# Altium schematic sheet AIR_Connection.SchDoc
size A4; Organization: Altium Limited; Address1: L3, 12a Rodborough Rd; Address2: Frenchs Forest; Address3: NSW; Address4: Australia 2086; Version: 1
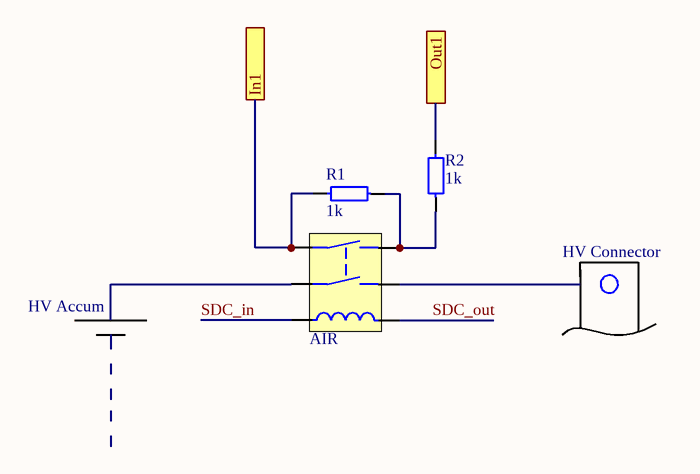
[diagram p0: AIR_Connection.SchDoc]

## Parts
*  AIR
R1  1k  [0603 Resistor]
R2  1k  [0603 Resistor]

## Ports
In1, Out1

## Nets
In1: *.4 R1.2 ; port In1
Out1: R2.2 ; port Out1
SDC_in: *.1
SDC_out: *.2
Net*_3: *.3 R1.1 R2.1

## Notes on the sheet
- HV Connector
- HV Accum
- Size:
- Date:
- A4
- Car#:
- Time:
- 418
- Team:
- Sheet
- BRT
- of
- University:
- Technical University
- Bauman Moscow State
- Document Version:

## Library data of the parts
* = Component_1
R1 R2 = Res 12k (0603): 0.1W 0603 12k, 1%; Part Number: RC0603FR-0712KL; Manufacturer: Taiwan; Type: Resistor; ComponentLink1Description: Chip&Dip; ComponentLink1URL: https://www.chipdip.ru/product0/9000079738